# Altium schematic sheet 3kWBatteryCharger.SchDoc
size A4
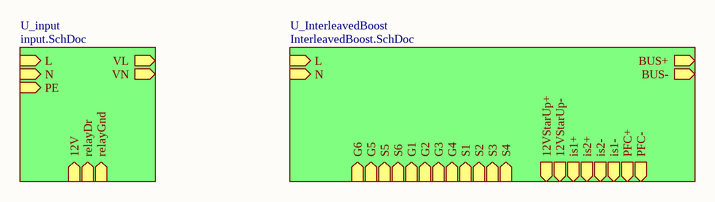
[diagram p0: 3kWBatteryCharger.SchDoc]

## Sub-sheets
U_input = input.SchDoc: L (in), N (in), PE (in), VL (out), VN (out), 12V (in), relayDr (in), relayGnd (in)
U_InterleavedBoost = InterleavedBoost.SchDoc: BUS+ (out), BUS- (out), L (in), N (in), 12VStarUp+ (out), G6 (in), G5 (in), S5 (in), S6 (in), 12VStarUp- (out), G1 (in), G2 (in), G3 (in), G4 (in), S1 (in), S2 (in), S3 (in), S4 (in), is1+ (out), is2+ (out), is2- (out), is1- (out), PFC+ (out), PFC- (out)

## Notes on the sheet
- Title
- Size:
- Date:
- A4
- Number:
- Time:
- Revision:
- Sheet
- of
- File: